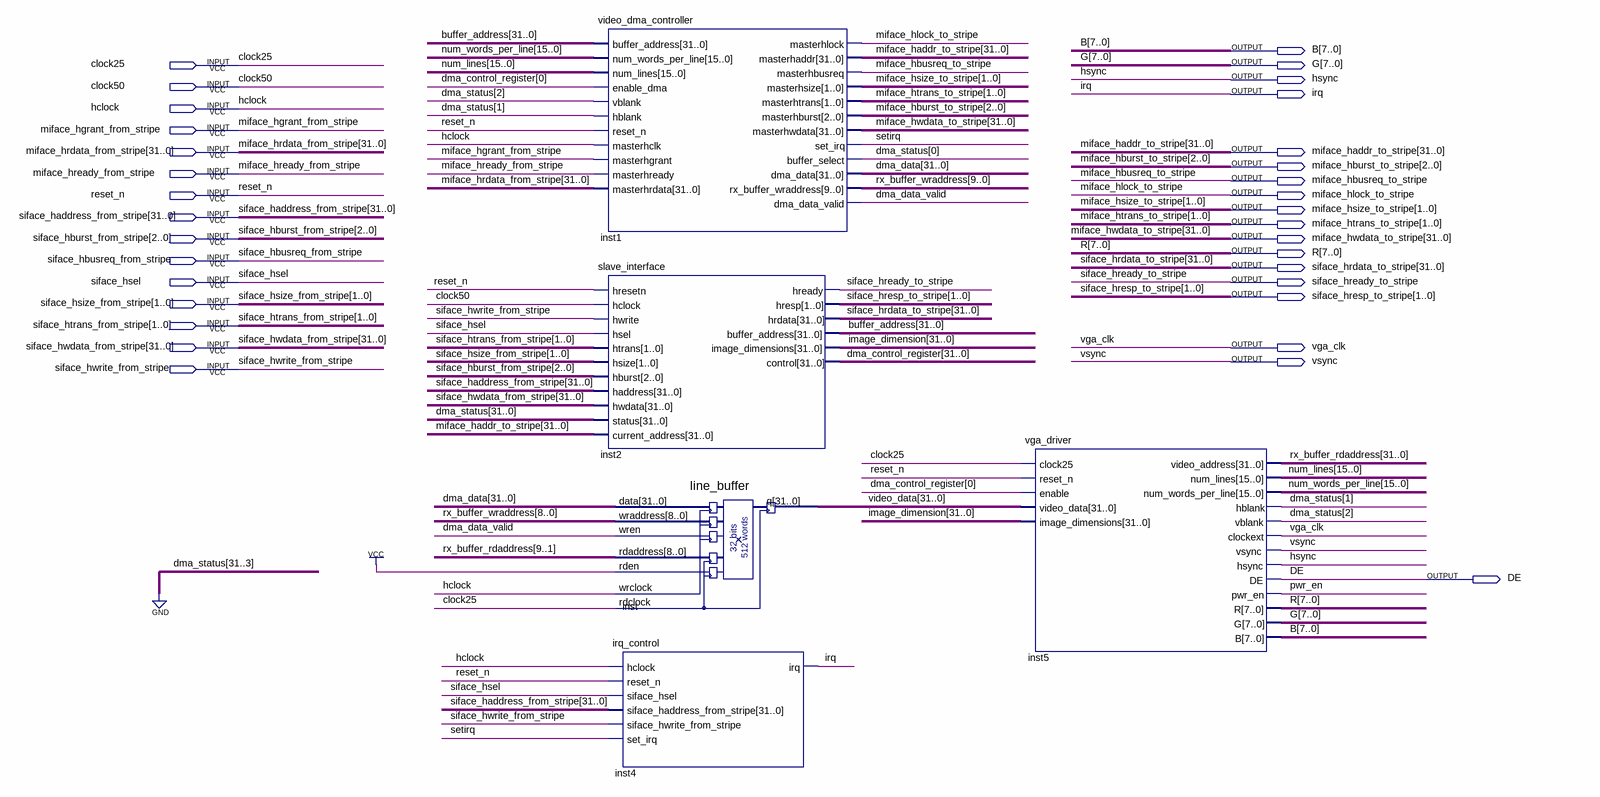
[diagram p0: schematic sheet]
// Quartus schematic video_dma3.bdf as structural Verilog: 5 symbols, 33 pins
module video_dma3 (
  input  clock25,
  input  clock50,
  input  hclock,
  input  miface_hgrant_from_stripe,
  input  [31:0] miface_hrdata_from_stripe,
  input  miface_hready_from_stripe,
  input  reset_n,
  input  [31:0] siface_haddress_from_stripe,
  input  [2:0] siface_hburst_from_stripe,
  input  siface_hbusreq_from_stripe,
  input  siface_hsel,
  input  [1:0] siface_hsize_from_stripe,
  input  [1:0] siface_htrans_from_stripe,
  input  [31:0] siface_hwdata_from_stripe,
  input  siface_hwrite_from_stripe,
  output [7:0] B,
  output [7:0] G,
  output hsync,
  output irq,
  output [31:0] miface_haddr_to_stripe,
  output [2:0] miface_hburst_to_stripe,
  output miface_hbusreq_to_stripe,
  output miface_hlock_to_stripe,
  output [1:0] miface_hsize_to_stripe,
  output [1:0] miface_htrans_to_stripe,
  output [31:0] miface_hwdata_to_stripe,
  output [7:0] R,
  output [31:0] siface_hrdata_to_stripe,
  output siface_hready_to_stripe,
  output [1:0] siface_hresp_to_stripe,
  output vga_clk,
  output vsync,
  output DE
);

  wire dma_data_valid, pwr_en, setirq;
  wire [2:0] dma_status;
  wire [9:0] rx_buffer_wraddress;
  wire [15:0] num_lines, num_words_per_line;
  wire [31:0] buffer_address, dma_control_register, dma_data, image_dimension, rx_buffer_rdaddress,
       video_data;

  video_dma_controller inst1 (
    .buffer_address(buffer_address), .num_words_per_line(num_words_per_line), .num_lines(num_lines),
    .enable_dma(dma_control_register[0]), .vblank(dma_status[2]), .hblank(dma_status[1]), .reset_n(reset_n),
    .masterhclk(hclock), .masterhgrant(miface_hgrant_from_stripe), .masterhready(miface_hready_from_stripe),
    .masterhrdata(miface_hrdata_from_stripe), .masterhlock(miface_hlock_to_stripe),
    .masterhaddr(miface_haddr_to_stripe), .masterhbusreq(miface_hbusreq_to_stripe),
    .masterhsize(miface_hsize_to_stripe), .masterhtrans(miface_htrans_to_stripe),
    .masterhburst(miface_hburst_to_stripe), .masterhwdata(miface_hwdata_to_stripe), .set_irq(setirq),
    .buffer_select(dma_status[0]), .dma_data(dma_data), .rx_buffer_wraddress(rx_buffer_wraddress),
    .dma_data_valid(dma_data_valid));
  slave_interface inst2 (
    .hresetn(reset_n), .hclock(clock50), .hwrite(siface_hwrite_from_stripe), .hsel(siface_hsel),
    .htrans(siface_htrans_from_stripe), .hsize(siface_hsize_from_stripe), .hburst(siface_hburst_from_stripe),
    .haddress(siface_haddress_from_stripe), .hwdata(siface_hwdata_from_stripe),
    .status({{29{1'b0}}, dma_status}), .current_address(miface_haddr_to_stripe),
    .hready(siface_hready_to_stripe), .hresp(siface_hresp_to_stripe), .hrdata(siface_hrdata_to_stripe),
    .buffer_address(buffer_address), .image_dimensions(image_dimension), .control(dma_control_register));
  line_buffer inst (
    .data(dma_data), .wraddress(rx_buffer_wraddress[8:0]), .wren(dma_data_valid),
    .rdaddress(rx_buffer_rdaddress[9:1]), .rden(1'b1), .wrclock(hclock), .rdclock(clock25), .q(video_data));
  irq_control inst4 (
    .hclock(hclock), .reset_n(reset_n), .siface_hsel(siface_hsel),
    .siface_haddress_from_stripe(siface_haddress_from_stripe),
    .siface_hwrite_from_stripe(siface_hwrite_from_stripe), .set_irq(setirq), .irq(irq));
  vga_driver inst5 (
    .clock25(clock25), .reset_n(reset_n), .enable(dma_control_register[0]), .video_data(video_data),
    .image_dimensions(image_dimension), .video_address(rx_buffer_rdaddress), .hblank(dma_status[1]),
    .vblank(dma_status[2]), .clockext(vga_clk), .vsync(vsync), .hsync(hsync), .DE(DE), .pwr_en(pwr_en),
    .R(R), .G(G), .B(B), .num_lines(num_lines), .num_words_per_line(num_words_per_line));
endmodule
